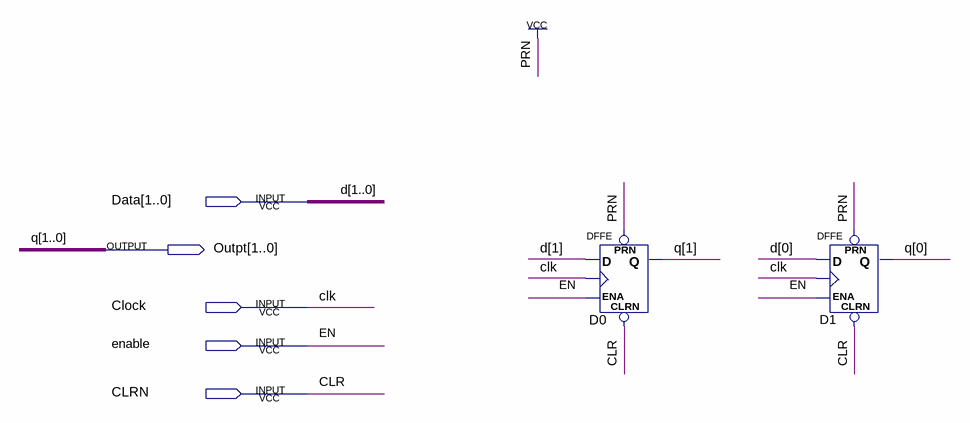
[diagram p0: schematic sheet]
// Quartus schematic Twobitreg.bdf as structural Verilog: 2 symbols, 5 pins
module Twobitreg (
  input  [1:0] Data,
  input  Clock,
  input  enable,
  input  CLRN,
  output [1:0] Outpt
);

  DFFE D0 (.PRN(1'b1), .CLRN(CLRN), .D(Data[1]), .CLK(Clock), .ENA(enable), .Q(Outpt[1]));
  DFFE D1 (.PRN(1'b1), .CLRN(CLRN), .D(Data[0]), .CLK(Clock), .ENA(enable), .Q(Outpt[0]));

  // Other names for the same wires on the sheet: clk = Clock; CLR = CLRN; d[1:0] = Data; EN = enable; q[1:0] = Outpt
endmodule
